# EAGLE design TL1P4 (EAGLE 7.7.0)
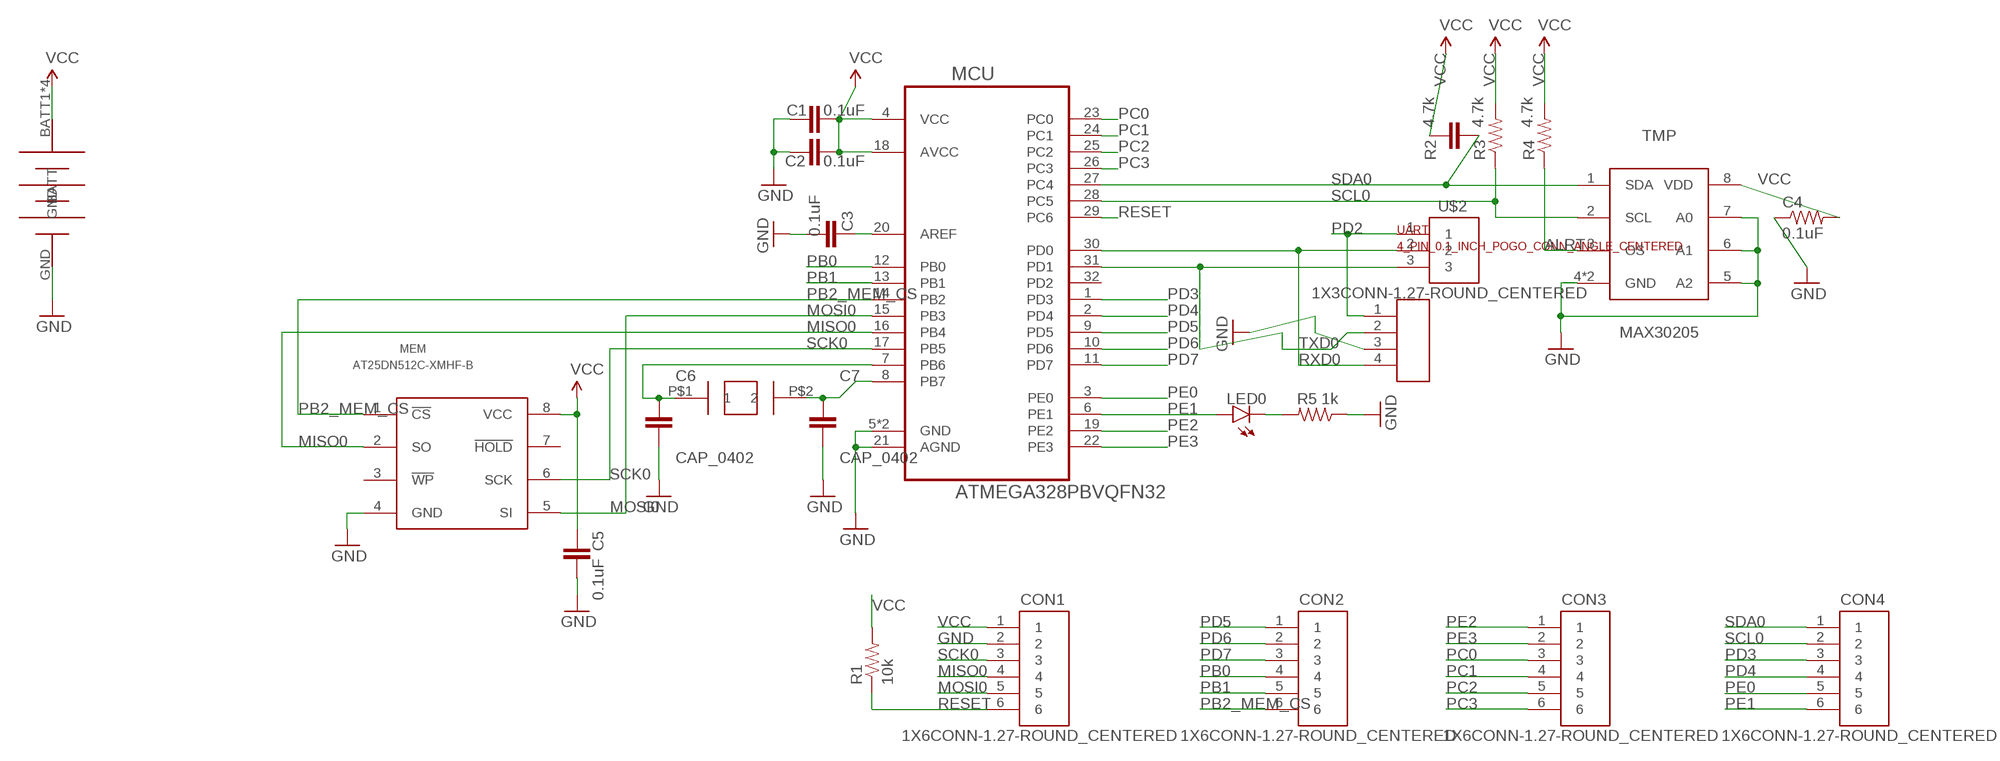
[diagram p0: schematic, sheet 1]

## Parts
C1  0.1uF  CAP_0201_CERAMIC  [RES_CAP_0201]
C2  0.1uF  CAP_0201_CERAMIC  [RES_CAP_0201]
C3  0.1uF  CAP_0201_CERAMIC  [RES_CAP_0201]
C4  0.1uF  RES_0201_CERAMIC  [RES_CAP_0201]
C5  0.1uF  CAP_0201_CERAMIC  [RES_CAP_0201]
C6  CAP_0402  [SMD_0402]
C7  CAP_0402  [SMD_0402]
CON1  1X6CONN-1.27-ROUND_CENTERED  [1X6_1.27_ROUND_CENTERED]
CON2  1X6CONN-1.27-ROUND_CENTERED  [1X6_1.27_ROUND_CENTERED]
CON3  1X6CONN-1.27-ROUND_CENTERED  [1X6_1.27_ROUND_CENTERED]
CON4  1X6CONN-1.27-ROUND_CENTERED  [1X6_1.27_ROUND_CENTERED]
LED0  LED_0402  [LED_0402]
MCU  ATMEGA328PBVQFN32  [ATMEGA328PB_VFQFN32]
MEM  AT25DN512C-XMHF-B  [TSSSOP-8]
R1  10k  RES_0201_CERAMIC  [RES_CAP_0201]
R2  4.7k  CAP_0201_CERAMIC  [RES_CAP_0201]
R3  4.7k  RES_0201_CERAMIC  [RES_CAP_0201]
R4  4.7k  RES_0201_CERAMIC  [RES_CAP_0201]
R5  1k  RES_0201_CERAMIC  [RES_CAP_0201]
T1  ABS07AIG  [ABS07AIG]
TMP  MAX30205  [MAX30205_TDFN8]
U$1  LINX-CR2032-BAT-HLD-THM  [CR2032-LINX-THM]
U$2  1X3CONN-1.27-ROUND_CENTERED  [1X3_1.27_ROUND_CENTERED]
UART  4_PIN_0.1_INCH_POGO_CONN_ANGLE_CENTERED  [4_PIN_0.1"_POGO_ANGLE_CENTERED]

## Nets
ALRT: R4.2 TMP.3(OS)
AREF: C3.1 MCU.20(AREF)
GND [GND]: C1.2 C2.2 C3.2 C4.2 C5.2 C6.2 C7.2 CON1.2 MCU.5(GND) MCU.21(AGND) MCU.PAD(GND) MEM.4(GND) R5.2 TMP.4(GND) TMP.5(A2) TMP.6(A1) TMP.7(A0) TMP.PAD(GND) U$1.GND UART.3
MISO0 [Signal]: CON1.4 MCU.16(PB4) MEM.2(SO)
MOSI0 [Signal]: CON1.5 MCU.15(PB3) MEM.5(SI)
N$1 [Signal]: C7.1 MCU.8(PB7) T1.P$2
N$2 [Signal]: C6.1 MCU.7(PB6) T1.P$1
N$4: LED0.CATHODE(C) R5.1
PB0: CON2.4 MCU.12(PB0)
PB1: CON2.5 MCU.13(PB1)
PB2_MEM_CS [Signal]: CON2.6 MCU.14(PB2) MEM.1(!CS!)
PC0: CON3.3 MCU.23(PC0)
PC1: CON3.4 MCU.24(PC1)
PC2: CON3.5 MCU.25(PC2)
PC3: CON3.6 MCU.26(PC3)
PD2: U$2.1 UART.1
PD3: CON4.3 MCU.1(PD3)
PD4: CON4.4 MCU.2(PD4)
PD5: CON2.1 MCU.9(PD5)
PD6: CON2.2 MCU.10(PD6)
PD7: CON2.3 MCU.11(PD7)
PE0: CON4.5 MCU.3(PE0)
PE1: CON4.6 LED0.ANODE(A) MCU.6(PE1)
PE2: CON3.1 MCU.19(PE2)
PE3: CON3.2 MCU.22(PE3)
RESET [Signal]: CON1.6 MCU.29(PC6) R1.2
RXD0 [Signal]: MCU.30(PD0) U$2.2 UART.4
SCK0 [Signal]: CON1.3 MCU.17(PB5) MEM.6(SCK)
SCL0 [Signal]: CON4.2 MCU.28(PC5) R3.2 TMP.2(SCL)
SDA0 [Signal]: CON4.1 MCU.27(PC4) R2.2 TMP.1(SDA)
TXD0 [Signal]: MCU.31(PD1) U$2.3 UART.2
VCC: C1.1 C2.1 C4.1 C5.1 CON1.1 MCU.4(VCC) MCU.18(AVCC) MEM.8(VCC) R1.1 R2.1 R3.1 R4.1 TMP.8(VDD) U$1.BATT1(BATT) U$1.BATT2(BATT) U$1.BATT3(BATT) U$1.BATT4(BATT)
Unconnected: MCU.32(PD2) MEM.3(!WP!) MEM.7(!HOLD!)

## Library data of the parts
C1-C3 C5 R2 = Passives:CAP_0201_CERAMIC
C4 R1 R3-R5 = Passives:RES_0201_CERAMIC
C6 C7 = Passives:CAP_0402: 0402 capacitor
CON1-CON4 = AVR_ISP_127:1X6CONN-1.27-ROUND_CENTERED
LED0 = Passives:LED_0402
MCU = ATMEGA328PB:ATMEGA328PB: Atmel's new 8-bit Microcontroller with In-System Programmable Flash and other goodies to replace venerable 328P
MEM = Memory:AT25DN512C-XMHF-B
T1 = ABS07AIG:ABS07AIG: Abracon ABS07AIG crystal
TMP = MAX30205:MAX30205: MAX30205 Temperature sensor by Maxim
U$1 = Battery_holders:LINX-CR2032-BAT-HLD-THM
U$2 = AVR_ISP_127:1X3CONN-1.27-ROUND_CENTERED
UART = Connectors:4_PIN_0.1_INCH_POGO_CONN_ANGLE_CENTERED

## Net classes
1 GND: width 0.254 mm, drill 0.305 mm, clearance 0.356 mm
2 Signal: width 0.152 mm, drill 0.305 mm, clearance 0.152 mm

## Board
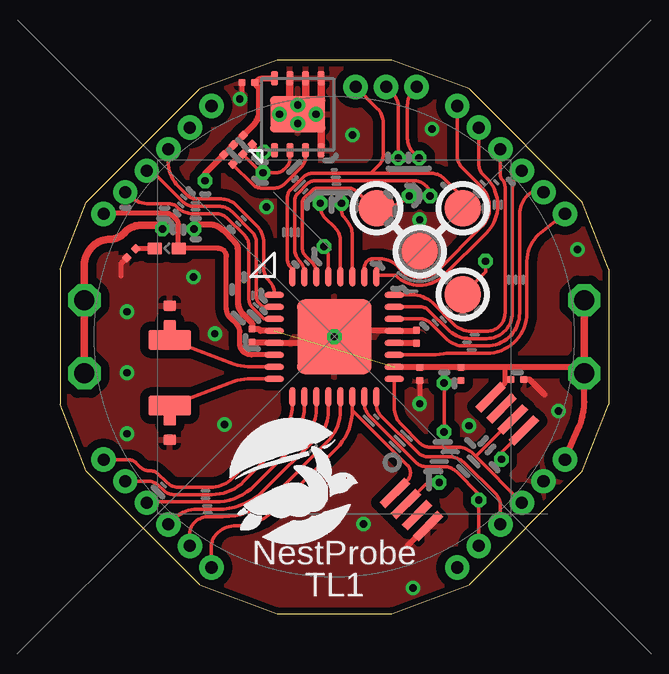
[diagram p1: board, top side]
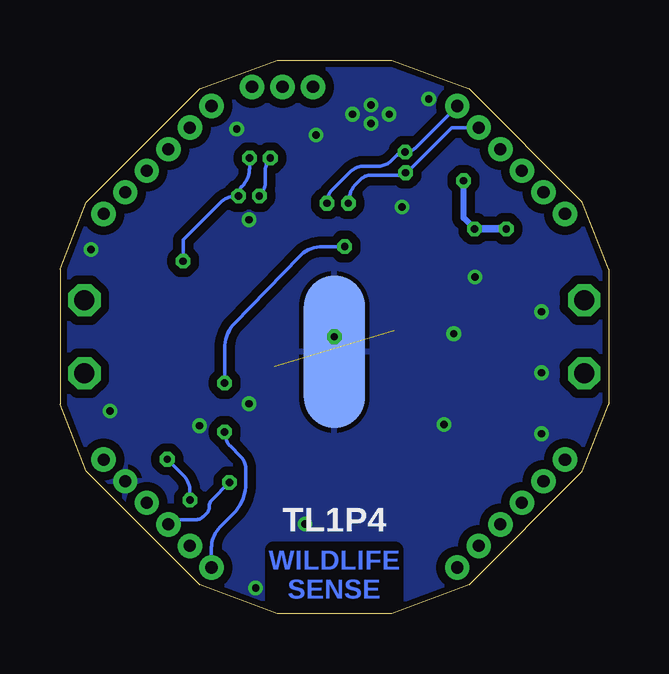
[diagram p2: board, bottom side, seen from below]

Size 22.86 x 23.06 mm. Coordinates in mm from the lower left corner, seen from the top.
Outline: 5.82,1.19 1.09,5.92 0,8.71 0,14.35 1.09,17.14 5.82,21.87 9.04,23.06 13.82,23.06 17.04,21.87 21.77,17.14 22.86,14.35 22.86,8.71 21.77,5.92 17.04,1.19 13.82,0 9.04,0 5.82,1.19
Copper layers (1*16): Top 0.035mm / dielectric 1.5mm / Bottom 0.035mm
Design rules "Nikos-SeeedStudio_2layer_DRU_no_angle_20140221": minimum track width 6mil, minimum drill 12mil, track to track 6mil, track to pad 10mil, pad to pad 10mil, via to via 10mil, smd to smd 6mil, copper to edge 10mil, drill to drill 10mil, minimum pad ring 10mil, minimum via ring 6mil, stop-mask expansion 0mil, vias tented up to drill 100mil, thermal gap 8mil

### Footprints (pad centres in the part's own frame; a part is rotated, then mirrored left to right if it is on the bottom)
RES_CAP_0201 = smd 0.3 x 0.3: 1 -0.27,0; 2 0.27,0
SMD_0402 = smd 0.54 x 0.42: 1 0,0.41; 2 0,-0.41
1X6_1.27_ROUND_CENTERED = drill 0.508 pad 0.813: 1 -3.175,0; 2 -1.905,0; 3 -0.635,0; 4 0.635,0; 5 1.905,0; 6 3.175,0
LED_0402 = smd 0.6 x 0.5: ANODE -0.5,0; CATHODE 0.5,0
ATMEGA328PB_VFQFN32 = smd 0.8 x 0.25: 1 -2.5,1.75; 2 -2.5,1.25; 3 -2.5,0.75; 4 -2.5,0.25; 5 -2.5,-0.25; 6 -2.5,-0.75; 7 -2.5,-1.25; 8 -2.5,-1.75; 17 2.5,-1.75; 18 2.5,-1.25; 19 2.5,-0.75; 20 2.5,-0.25; 21 2.5,0.25; 22 2.5,0.75; 23 2.5,1.25; 24 2.5,1.75 | smd 0.25 x 0.8: 9 -1.75,-2.5; 10 -1.25,-2.5; 11 -0.75,-2.5; 12 -0.25,-2.5; 13 0.25,-2.5; 14 0.75,-2.5; 15 1.25,-2.5; 16 1.75,-2.5; 25 1.75,2.5; 26 1.25,2.5; 27 0.75,2.5; 28 0.25,2.5; 29 -0.25,2.5; 30 -0.75,2.5; 31 -1.25,2.5; 32 -1.75,2.5 | smd 3.1 x 3.1: PAD 0,0
TSSSOP-8 = smd 1.45 x 0.35: 1 -2.825,0.975; 2 -2.825,0.325; 3 -2.825,-0.325; 4 -2.825,-0.975; 5 2.825,-0.975; 6 2.825,-0.325; 7 2.825,0.325; 8 2.825,0.975
ABS07AIG = smd 1.778 x 0.813: P$1 0,1.372; P$2 0,-1.372
MAX30205_TDFN8 = smd 0.6 x 0.3: 1 -1.5,0.975; 2 -1.5,0.325; 3 -1.5,-0.325; 4 -1.5,-0.975; 5 1.5,-0.975; 6 1.5,-0.325; 7 1.5,0.325; 8 1.5,0.975 | smd 1.5 x 2.3: PAD 0,0
CR2032-LINX-THM = drill 0.838 octagon: BATT1 -10.414,1.524; BATT2 -10.414,-1.524; BATT3 10.414,-1.524; BATT4 10.414,1.524 | smd 2.54 x 6.35: GND 0,-0.635
1X3_1.27_ROUND_CENTERED = drill 0.508 pad 0.813: 1 0.635,0; 2 1.905,0; 3 3.175,0
4_PIN_0.1"_POGO_ANGLE_CENTERED = smd 1.524 x 1.524: 1 0,2.54; 2 2.54,0; 3 0,0; 4 -2.54,0

### Placement (x,y rotation side)
C1  8,11.58 270 top
C2  14.99,9.98 270 top
C3  14.86,11.53 90 top
C4  7.85,22.12 180 top
C5  19.05,9.75 0 top
C6  4.57,12.42 180 top
C7  4.57,7.64 0 top
CON1  18.8,4.17 225 top
CON2  4.06,4.17 315 top
CON3  18.8,18.9 135 top
CON4  4.06,18.9 225 top
LED0  4.45,15.21 180 top
MCU  11.43,11.53 0 top
MEM  16.64,6.32 45 top
R1  16.71,9.98 270 top
R2  7.82,19.74 315 top
R3  7.42,19.33 315 top
R4  7.01,18.92 315 top
R5  2.97,15.01 225 top
T1  4.57,10.03 0 top
TMP  9.91,20.8 90 top
U$1  11.43,11.53 0 bottom
U$2  11.68,21.95 0 top
UART  14.99,15.09 315 top

### Tracks (layer width: path | path; a pad name or v marks a point on that pad's centre or on a via)
ALRT
  Top 0.152: TMP.3 10.23,19.04 arc-45 10.05,18.6 9.32,17.87 arc-45 8.97,17.73 8.37,17.73 arc-45 8.05,17.86 7.17,18.74 R4.2
AREF
  Top 0.203: 14.86,11.28 C3.1
  Top 0.249: MCU.20 14.86,11.28
GND  (via drill 0.3)
  Top 0.203: 8,11.28 C1.2 | C2.2 v14.99,8.74 | 14.86,11.78 C3.2 | C5.2 19.3,9.75 | R5.2 2.54,14.58 2.54,14.07 | C4.2 7.58,21.52 v7.49,21.44
  Top 0.249: 10.67,11.28 MCU.5 8,11.28 | MCU.21 14.86,11.78
  Top 0.254: 10.67,11.28 10.92,11.53 MCU.PAD 11.68,11.78 MCU.21 | 14.48,2.79 15.24,3.56 | 19.3,9.75 19.56,9.75 20.19,9.12
  Top 0.305: TMP.4 10.88,20.68 v10.67,20.8 10.88,20.8 TMP.5 | TMP.6 10.23,21.18 v9.91,21.18 | TMP.7 9.58,21.44 v9.14,20.8
  other vias: 2.79,7.49 9.91,20.42 2.79,10.03 21.56,15.16 6.45,11.66 5.56,14.02 20.78,8.43 14.99,16.41 14.71,1.07 12.65,3.73 2.79,12.57 11.43,11.53 17.04,7.82 12.19,19.94 8.61,16.94 6.86,7.87 15.49,20.19
  pour Bottom: -1.27,-1.17 24.13,-1.17 24.13,24.23 -1.27,24.23
  pour Top: -1.27,-1.17 24.13,-1.17 24.13,24.23 -1.27,24.23
MISO0  (via drill 0.3)
  Top 0.152: CON1.4 18.35,4.49 arc45 18.13,5.01 16.89,6.24 arc45 16.21,6.53 15.35,6.53 arc-45 14.91,6.71 13.39,8.22 arc-45 13.18,8.74 MCU.16 | MEM.2 15.15,5.3 arc-45 15.55,5.46 v15.8,5.46
  Bottom 0.152: v15.8,5.46 16.54,4.72 arc-45 16.64,4.49 16.64,4.46 arc45 16.75,4.17 16.9,4.03 arc45 17.18,3.91 17.89,3.91 arc-46 CON1.4
MOSI0  (via drill 0.3)
  Top 0.152: MCU.15 12.68,8.78 arc45 12.91,8.22 14.83,6.31 arc45 15.27,6.12 16,6.12 arc-45 16.53,5.9 17.45,4.98 v17.45,4.72 CON1.5 | MEM.5 18.39,6.7 v18.39,6.43
  Bottom 0.152: v18.39,6.43 17.73,5.76 arc45 17.45,5.09 v17.45,4.72
N$1
  Top 0.152: MCU.8 7.96,9.78 arc18 7.26,9.67 5.34,8.95 4.57,8.95 T1.P$2
  Top 0.203: C7.1 T1.P$2
N$2
  Top 0.152: MCU.7 7.96,10.28 arc-18 7.26,10.39 5.34,11.11 4.57,11.11 T1.P$1
  Top 0.203: C6.1 T1.P$1
N$4
  Top 0.203: R5.1 3.23,15.21 LED0.CATHODE
PB0
  Top 0.152: MCU.12 11.18,8.41 arc-45 10.75,7.37 8.46,5.11 arc-45 6.6,4.34 5.7,4.34 arc45 4.74,3.95 CON2.4
PB1
  Top 0.152: MCU.13 11.68,8.46 arc-45 11.14,7.15 8.9,4.91 arc-45 6.79,4.04 6.2,4.04 arc45 5.59,3.79 arc45 5.41,3.35 CON2.5
PB2_MEM_CS
  Top 0.152: MCU.14 12.18,8.47 | MEM.1 14.47,5.54 arc45 14.61,5.86 arc45 14.47,6.18 12.18,8.47 | 12.18,8.47 arc-45 11.52,6.87 9,4.35 arc-45 7.33,3.66 arc45 6.53,3.32 arc45 6.31,2.8 CON2.6
PC0
  Top 0.152: CON3.3 19.11,18.31 arc45 18.85,17.68 18.85,12.52 arc-90 17.78,11.46 17.07,11.46 arc-45 16.16,11.83 15.37,12.62 arc45 14.99,12.78 MCU.23
PC1
  Top 0.152: MCU.24 14.53,13.28 arc-45 15.53,12.95 16.4,12.05 arc45 17.22,11.76 17.78,11.76 arc90 18.54,12.52 18.54,17.78 arc45 18.42,18.08 arc-45 18.35,18.25 CON3.4
PC2
  Top 0.152: CON3.5 17.45,18.82 17.45,18.72 17.45,18.71 arc45 17.62,18.29 17.77,18.15 arc-45 18.24,17.01 18.24,16.98 arc-45 17.78,15.87 15.99,14.08 arc-90 13.98,14.08 13.23,14.08 MCU.25
PC3
  Top 0.152: MCU.26 12.68,14.4 arc-45 12.79,14.67 arc-45 13.06,14.78 13.34,14.78 arc-45 14.02,14.5 14.21,14.31 arc90 15.76,14.31 17.56,16.11 arc45 17.89,16.92 arc45 17.53,17.8 16.77,18.57 arc-45 16.55,19.08 CON3.6
PD2
  Top 0.152: 12.95,18.34 10.5,18.34 arc45 10.13,18.19 9.61,17.66 arc45 9.47,17.34 9.47,14.73 arc45 9.58,14.47 arc-45 9.68,14.24 | 12.95,18.34 15.48,18.34 arc-40 15.97,18.16 16.78,17.35 UART.1 | U$2.1 13.23,21.04 arc-45 13.46,20.47 13.46,19.12 arc-45 13.27,18.65 12.95,18.34
PD3
  Top 0.152: MCU.1 8.93,13.33 arc45 8.7,13.88 arc-45 8.48,14.41 8.48,15.48 arc45 8.2,16.15 7.35,17.01 arc45 6.71,17.27 5.69,17.27 arc-45 5.3,17.43 4.93,17.8 arc-45 4.51,18.82 CON4.3
PD4
  Top 0.152: MCU.2 8.45,12.78 8.28,12.95 arc-45 8.18,13.2 8.18,15.47 arc45 8,15.9 7.17,16.73 arc45 6.6,16.97 5.56,16.97 arc-45 5.13,17.14 3.83,18.45 CON4.4
PD5
  Top 0.152: MCU.9 9.68,8.61 arc-45 9.34,7.79 7.18,5.63 arc-45 6.28,5.26 4.98,5.26 arc-45 4.42,5.49 4.08,5.82 arc45 3.79,5.94 3.73,5.94 arc-45 3.35,6.1 3.18,6.27 arc45 2.84,6.41 CON2.1
PD6
  Top 0.152: MCU.10 10.18,8.52 arc-45 9.83,7.67 7.66,5.5 arc-45 6.33,4.95 4.77,4.95 arc-45 4.3,5.15 4.12,5.33 arc45 3.67,5.51 CON2.2
PD7
  Top 0.152: MCU.11 10.68,8.47 arc-45 10.28,7.51 8.09,5.32 arc-45 6.46,4.65 3.65,4.65 CON2.3
PE0
  Top 0.152: MCU.3 8.5,12.28 7.99,12.78 arc-45 7.87,13.07 7.87,15.31 arc45 7.69,15.75 6.99,16.45 arc45 6.49,16.66 5.53,16.66 arc-45 4.89,16.93 arc45 4.55,17.07 3.73,17.07 arc-45 2.82,17.45 CON4.5
PE1
  Top 0.203: MCU.6 7.97,10.78 arc-45 7.61,10.93 arc-45 7.49,11.21 7.49,11.72 arc45 7.36,12.05 7.1,12.31 arc-45 6.93,12.7 6.93,14.87 arc45 6.84,15.11 arc45 6.58,15.21 LED0.ANODE 4.93,15.23 4.93,16.23 arc45 4.85,16.41 4.71,16.55 arc45 4.38,16.69 1.85,16.69 CON4.6
PE2
  Top 0.152: 20.7,16.31 CON3.1 20.04,15.87 arc52 19.46,14.69 19.46,12.52 arc-90 17.78,10.85 16.32,10.85 arc9 15.99,10.82 arc-9 15.5,10.78 MCU.19
PE3
  Top 0.152: MCU.22 15.02,12.28 arc-45 15.42,12.12 16.06,11.47 arc45 16.84,11.15 17.78,11.15 arc90 19.15,12.52 19.15,16.65 arc-45 19.47,17.41 arc-45 19.8,17.55 CON3.2
RESET  (via drill 0.3)
  Top 0.152: MCU.29 11.18,14.86 arc45 v11,15.29 | v16,7.57 v16,9.6 16.11,9.71 R1.2
  Top 0.254: MCU.29
  Bottom 0.152: v11,15.29 11.92,15.29 arc-46 12.9,14.87 15.57,12.1 arc-44 16,11.04 v16,9.6 | v16,7.57 arc-45 15.75,6.96 15.36,6.57 arc45 15.11,5.97 15.11,5.44 arc45 15.66,4.13 16.2,3.59 arc-45 16.55,2.73 CON1.6
RXD0  (via drill 0.3)
  Top 0.152: MCU.30 10.68,14.2 arc45 10.51,14.61 10.26,14.86 arc-45 10.08,15.29 10.08,17.08 arc-45 10.19,17.32 10.49,17.62 arc-45 10.74,17.73 11.99,17.73 arc-45 12.38,17.57 13.06,16.88 UART.4 13.31,16.88 arc45 v14.55,17.4 | U$2.2 13.86,21.68 arc-45 14.1,21.1 v14.1,18.97
  Bottom 0.152: v14.1,18.97 arc-45 14.3,18.48 14.3,18.01 arc45 v14.55,17.4
SCK0
  Top 0.152: MCU.17 13.93,8.57 arc45 14.22,7.88 15,7.1 arc45 15.4,6.93 16.53,6.93 arc-45 17.21,6.65 17.34,6.52 | CON1.3 17.34,6.52 | MEM.6 17.34,6.57 17.34,6.52
SCL0  (via drill 0.3)
  Top 0.152: TMP.2 9.58,18.93 arc-45 9.45,18.62 9.34,18.51 arc-45 8.98,18.36 v8.46,18.36 arc-45 8.33,18.42 R3.2 | MCU.28 11.68,15.52 arc45 11.45,16.09 11.06,16.47 arc-45 10.85,16.99 v10.85,17.09
  Bottom 0.152: CON4.2 6.53,20.24 8.41,18.36 v8.46,18.36 arc45 8.7,18.26 9.93,18.26 arc-45 10.33,18.1 10.51,17.92 arc-45 v10.85,17.1 v10.85,17.09
SDA0  (via drill 0.3)
  Top 0.152: MCU.27 12.18,15.76 arc40 11.97,16.34 11.84,16.5 arc-43 11.72,16.87 v11.74,17.09 | R2.2 8.33,19.23 v8.48,19.23 8.86,19.23 TMP.1
  Bottom 0.152: CON4.1 8.06,19.39 arc45 v8.48,19.23 arc-45 8.85,19.07 9.05,18.86 arc45 9.58,18.64 10.16,18.64 arc-45 10.81,18.38 11.48,17.7 arc-45 v11.74,17.09
TXD0  (via drill 0.3)
  Top 0.152: MCU.31 10.18,14.23 arc45 10,14.66 arc-45 9.78,15.2 9.78,17.21 arc-45 9.9,17.49 10.3,17.9 arc-45 10.63,18.03 14.72,18.03 arc-45 15.28,17.8 arc-45 15.42,17.46 v15.42,17.4 | v14.96,18.97 14.71,19.23 arc-45 14.48,19.78 14.48,21.19 arc-45 14.75,21.83 U$2.3 | v17.73,14.68 17.73,14.24 UART.2
  Bottom 0.152: v14.96,18.97 14.96,18.56 arc45 15.28,17.8 arc-45 15.42,17.46 v15.42,17.4 15.51,17.4 arc-45 16.18,17.12 17.73,15.57 v17.73,14.68
VCC  (via drill 0.3)  (1 unrouted)
  Top 0.203: C2.1 14.99,10.28 | MEM.8 18.54,9.61 18.54,9.75 | C5.1 18.54,9.75 | 8,11.81 C1.1 | 18.54,9.75 18.54,10.28 | R1.1 16.71,10.23 16.76,10.28 | C4.1 arc-90 8.19,22.08 8.19,22.07 | R4.1 arc90 6.86,19.08 6.86,19.15 | R3.1 arc-90 7.24,19.51 7.24,19.53 | R2.1 arc90 7.64,19.91 7.62,19.91
  Top 0.249: MCU.18 14.99,10.28 | 8,12.09 C1.1 8.02,11.84 8.31,11.84 8.36,11.78 MCU.4
  Top 0.254: CON1.1 21.64,7.8 arc23 21.84,8.8 U$1.BATT2 21.84,10.28 18.54,10.28 16.76,10.28 14.99,10.28 | v6.04,18.03 6.04,18.34 6.86,19.15 7.24,19.53 7.62,19.91 8.06,20.35 arc45 8.31,20.95 8.31,21.73 arc45 8.19,22.01 8.19,22.07 8.19,22.18 arc-45 8.5,22.3 TMP.8 | 8,12.09 7.65,12.44 arc-45 7.42,13.01 7.42,15.13 arc45 7.27,15.49 6.78,15.98 arc45 6.24,16.21 5.77,16.21 v5.59,16.03
  Top 0.305: 2.1,15.6 arc90 1.02,14.51 U$1.BATT4 U$1.BATT3 | 2.1,15.6 2.11,15.6 | 2.1,15.6 arc45 2.72,15.9 arc-45 3.39,16.18 4.12,16.18 v4.27,16.03 | U$1.BATT1 U$1.BATT2
  Bottom 0.254: v5.59,16.03 6.04,16.48 v6.04,18.03
  Bottom 0.305: v4.27,16.03 v5.59,16.03

### Text on the board
Bottom: WILDLIFE / SENSE
tPlace: NestProbe / TL1
bPlace: TL1P4